# Altium schematic sheet Schematic.schdoc
size 918 x 212 mm
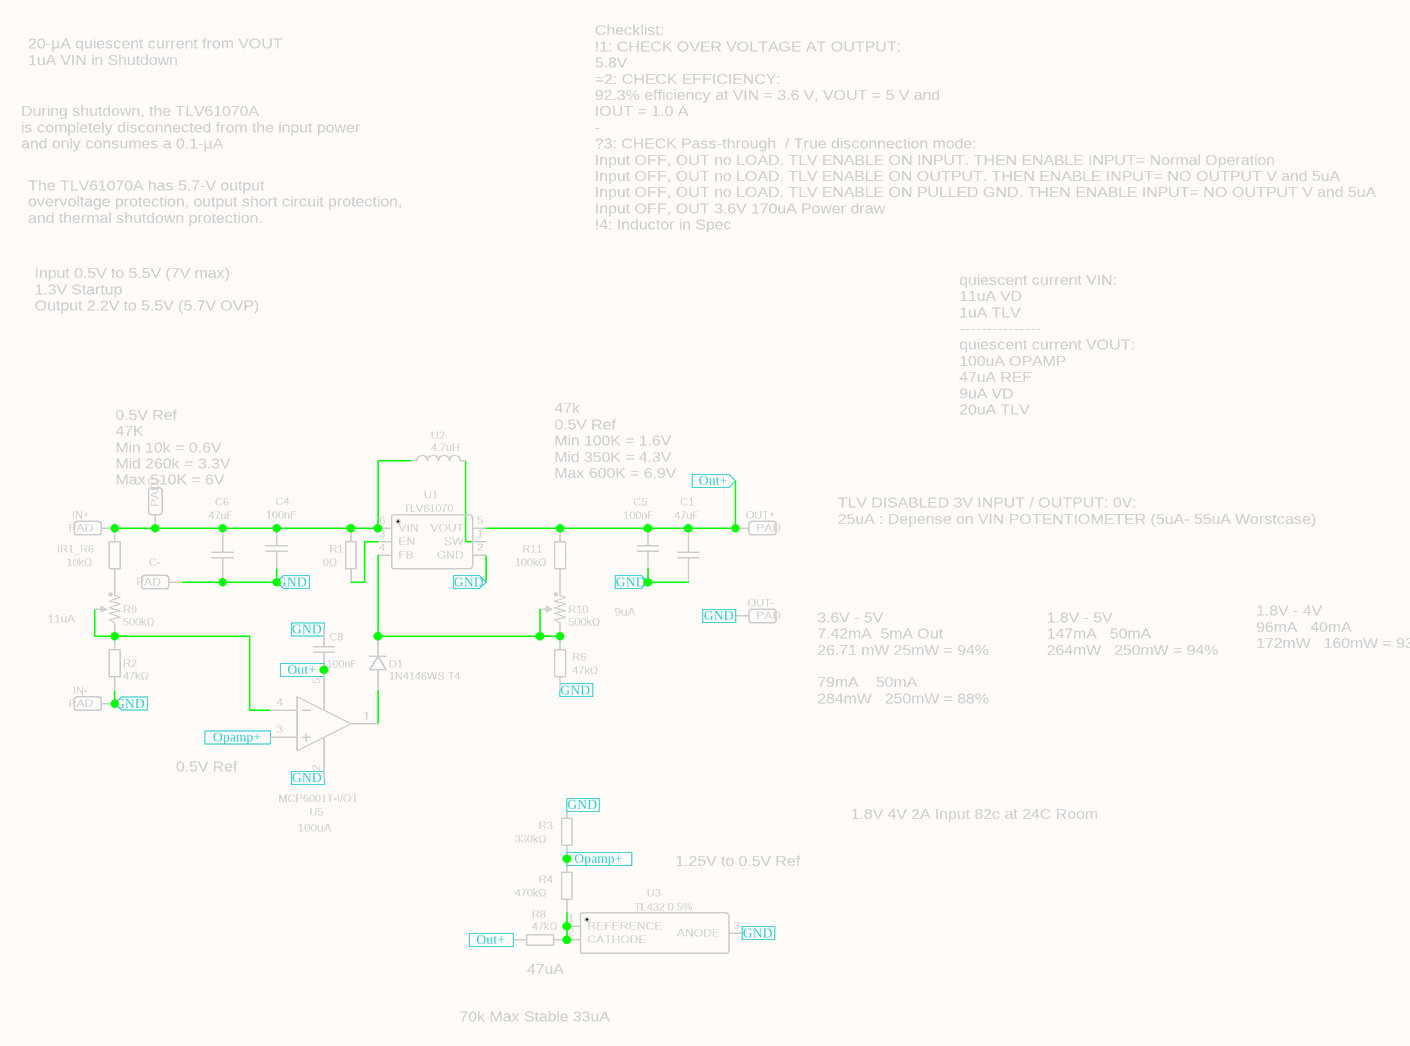
[diagram p0: Schematic.schdoc]

## Parts
C1  47uF  [C1206]
C4  100nF  [C0402]
C5  100nF  [C0402]
C6  47uF  [C1206]
C8  100nF  [C0402]
C+  ThroughHole  [THRO_HOLE_FP]  (value not drawn)
C-  ThroughHole  [THRO_HOLE_FP]  (value not drawn)
D1  1N4148WS T4  [SOD-323_L1.8-W1.3-LS2.5-RD]
IN+  ThroughHole  [THRO_HOLE_FP]  (value not drawn)
IN-  ThroughHole  [THRO_HOLE_FP]  (value not drawn)
IR1_R6  10kΩ  [R0402]
OUT+  ThroughHole  [THRO_HOLE_FP]  (value not drawn)
OUT-  ThroughHole  [THRO_HOLE_FP]  (value not drawn)
R1  0Ω  [R0805]
R2  47kΩ  [R0402]
R3  330kΩ  [R0603]
R4  470kΩ  [R0603]
R6  47kΩ  [R0402]
R8  47kΩ  [R0402]
R9  500kΩ  [RES-ADJ-SMD_3313J-1]
R10  500kΩ  [RES-ADJ-SMD_3313J-1]
R11  100kΩ  [R0402]
U1  TLV61070  [SOT-23-6_L2.9-W1.6-P0.95-LS2.8-BR]
U2  4.7uH  [IND-SMD_L7.0-W6.6_APH0630]
U3  TL432 0.5%  [SOT-23-3_L2.9-W1.3-P1.90-LS2.4-BR]
U5  MCP6001T-I/OT  [SOT-23-5_L3.0-W1.7-P0.95-LS2.8-BR]

## Ports
GND (in), Opamp+ (in), Out+ (in)

## Nets
GND: C1.1 C4.1 C5.1 C6.1 C8.2 C-.1(PAD) IN-.1(PAD) OUT-.1(PAD) R2.1 R3.2 R6.1 U1.2(GND) U3.3(ANODE) U5.2(VSS) ; port GND
Opamp+: R3.1 R4.2 U5.3(VIN+) ; port Opamp+
Out+: C1.2 C5.2 C8.1 OUT+.1(PAD) R8.2 R11.2 U1.5(VOUT) U5.5(VDD) ; port Out+
NetC4_2: C4.2 C6.2 C+.1(PAD) IN+.1(PAD) IR1_R6.1 R1.2 U1.6(VIN) U2.1
NetD1_1: D1.1(K) R6.2 R10.2 R10.3 U1.4(FB)
NetD1_2: D1.2(A) U5.1(VOUT)
NetIR1_R6_2: IR1_R6.2 R9.1
NetR1_1: R1.1 U1.3(EN)
NetR2_2: R2.2 R9.2 R9.3 U5.4(VIN-)
NetR4_1: R4.1 R8.1 U3.1(REFERENCE) U3.2(CATHODE)
NetR10_1: R10.1 R11.1
NetU1_1: U1.1(SW) U2.2

## Notes on the sheet
- 20-µA quiescent current from VOUT
  1uA VIN in Shutdown
- Checklist:
  !1: CHECK OVER VOLTAGE AT OUTPUT:
  5.8V
  =2: CHECK EFFICIENCY:
  92.3% efficiency at VIN = 3.6 V, VOUT = 5 V and
  IOUT = 1.0 A
  -
  ?3: CHECK Pass-through  / True disconnection mode:
  Input OFF, OUT no LOAD. TLV ENABLE ON INPUT. THEN ENABLE INPUT= Normal Operation
  Input OFF, OUT no LOAD. TLV ENABLE ON OUTPUT. THEN ENABLE INPUT= NO OUTPUT V and 5uA
  Input OFF, OUT no LOAD. TLV ENABLE ON PULLED GND. THEN ENABLE INPUT= NO OUTPUT V and 5uA
  Input OFF, OUT 3.6V 170uA Power draw
  !4: Inductor in Spec
- During shutdown, the TLV61070A
  is completely disconnected from the input power
  and only consumes a 0.1-µA
- The TLV61070A has 5.7-V output
  overvoltage protection, output short circuit protection,
  and thermal shutdown protection.
- Input 0.5V to 5.5V (7V max)
  1.3V Startup
  Output 2.2V to 5.5V (5.7V OVP)
- quiescent current VIN:
  11uA VD
  1uA TLV
  ---------------
  quiescent current VOUT:
  100uA OPAMP
  47uA REF
  9uA VD
  20uA TLV
- 0.5V Ref
  47K
  Min 10k = 0.6V
  Mid 260k = 3.3V
  Max 510K = 6V
- 47k
  0.5V Ref
  Min 100K = 1.6V
  Mid 350K = 4.3V
  Max 600K = 6.9V
- TLV DISABLED 3V INPUT / OUTPUT: 0V:
  25uA : Depense on VIN POTENTIOMETER (5uA- 55uA Worstcase)
- 11uA
- 9uA
- 3.6V - 5V
  7.42mA  5mA Out
  26.71 mW 25mW = 94%
  79mA    50mA
  284mW   250mW = 88%
- 1.8V - 5V
  147mA   50mA
  264mW   250mW = 94%
- 1.8V - 4V
  96mA   40mA
  172mW   160mW = 93%
- 0.5V Ref
- 100uA
- 1.8V 4V 2A Input 82c at 24C Room
- 1.25V to 0.5V Ref
- 47uA
- 70k Max Stable 33uA

## Library data of the parts
C1 C6 = 47uF: Manufacturer: SAMSUNG(三星); Manufacturer Part: CL31A476MPHNNNE; nameAlias: Value; Supplier: LCSC; Supplier Part: C96123; JLCPCB Part Class: Basic Part; spicePre: C; spiceSymbolName: CL31A476MPHNNNE
C4 C5 C8 = 100nF: Manufacturer Part: CL05B104KO5NNNC; Manufacturer: SAMSUNG(三星); nameAlias: Value; Supplier: LCSC; Supplier Part: C1525; JLCPCB Part Class: Basic Part; spicePre: C; spiceSymbolName: CL05B104KO5NNNC
C+ C- IN+ IN- OUT+ OUT- = ThroughHole: Contributor: mozjuhin; Supplier: N/A; spicePre: U; spiceSymbolName: ThroughHole
D1 = 1N4148WS T4: Manufacturer: CJ(江苏长电/长晶); Supplier: LCSC; Manufacturer Part: 1N4148WS; Supplier Part: C2128; JLCPCB Part Class: Basic Part; spicePre: D; spiceSymbolName: 1N4148WS T4
IR1_R6 = 10kΩ: Manufacturer: UNI-ROYAL(厚声); Manufacturer Part: 0402WGF1002TCE; nameAlias: Resistance; Resistance (Ohms): 10K; Supplier: LCSC; Supplier Part: C25744; JLCPCB Part Class: Basic Part; spicePre: R; spiceSymbolName: 0402WGF1002TCE
R1 = 0Ω: Manufacturer: UNI-ROYAL(厚声); Manufacturer Part: 0805W8F0000T5E; nameAlias: Value; Supplier: LCSC; Supplier Part: C17477; JLCPCB Part Class: Basic Part; spicePre: R; spiceSymbolName: 0805W8F0000T5E
R2 R6 R8 = 47kΩ: Manufacturer: UNI-ROYAL(厚声); Manufacturer Part: 0402WGF4702TCE; nameAlias: Value; Supplier: LCSC; Supplier Part: C25792; JLCPCB Part Class: Basic Part; spicePre: R; spiceSymbolName: 0402WGF4702TCE
R3 = 330kΩ: Manufacturer: UNI-ROYAL(厚声); Manufacturer Part: 0603WAF3303T5E; nameAlias: Value; Supplier: LCSC; Supplier Part: C23137; JLCPCB Part Class: Basic Part; spicePre: R; spiceSymbolName: 0603WAF3303T5E
R4 = 470kΩ: Manufacturer: UNI-ROYAL(厚声); Manufacturer Part: 0603WAF4703T5E; nameAlias: Value; Supplier: LCSC; Supplier Part: C23178; JLCPCB Part Class: Basic Part; spicePre: R; spiceSymbolName: 0603WAF4703T5E
R9 R10 = 500kΩ: Manufacturer: BOURNS; Manufacturer Part: 3313J-1-504E; Resistance(Ohms): 500K; nameAlias: Value; Contributor: LCSC; Supplier: LCSC; Supplier Part: C124628; JLCPCB Part Class: Extended Part; spicePre: R; spiceSymbolName: 3313J-1-504E
R11 = 100kΩ: Manufacturer: UNI-ROYAL(厚声); Manufacturer Part: 0402WGF1003TCE; nameAlias: Value; Supplier: LCSC; Supplier Part: C25741; JLCPCB Part Class: Basic Part; spicePre: R; spiceSymbolName: 0402WGF1003TCE
U1 = TLV61070: Manufacturer: TI(德州仪器); Manufacturer Part: TLV61070ADBVR; Contributor: lcsc; Supplier: LCSC; Supplier Part: C6881375; spicePre: U; spiceSymbolName: TLV61070ADBVR
U2 = 4.7uH: Manufacturer: APV(爱普微); Manufacturer Part: APH0630T4R7M; nameAlias: Value; Contributor: lcsc; Supplier: LCSC; Supplier Part: C5349705; JLCPCB Part Class: Extended Part; spicePre: U; spiceSymbolName: APH0630T4R7M
U3 = TL432 0.5%: Manufacturer: UMW(友台半导体); Contributor: LCSC; Supplier: LCSC; Supplier Part: C545558; Manufacturer Part: TL432 0.5%; JLCPCB Part Class: Extended Part; spicePre: U; spiceSymbolName: TL432 0.5%
U5 = MCP6001T-I/OT: Manufacturer: MICROCHIP(美国微芯); Supplier: LCSC; Manufacturer Part: MCP6001T-I/OT; Supplier Part: C116490; JLCPCB Part Class: Extended Part; spicePre: U; spiceSymbolName: MCP6001T-I/OT